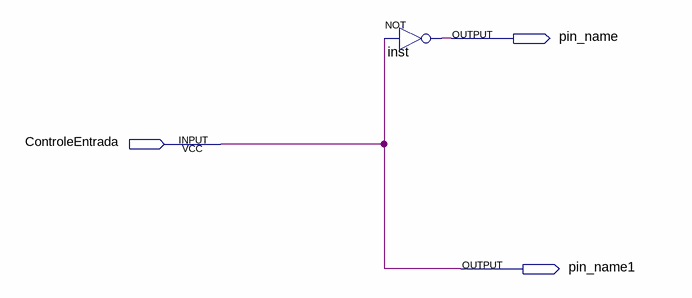
[diagram p0: schematic sheet]
// Quartus schematic ControleLeds.bdf as structural Verilog: 1 symbols, 3 pins
module ControleLeds (
  input  ControleEntrada,
  output pin_name,
  output pin_name1
);

  not inst (pin_name, ControleEntrada);

  assign pin_name1 = ControleEntrada;
endmodule
